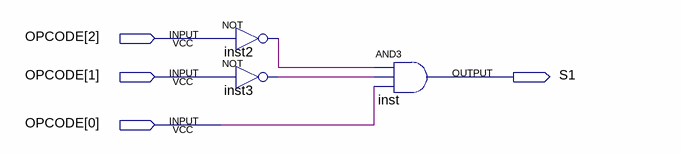
[diagram p0: schematic sheet]
// Quartus schematic DecoSUMA.bdf as structural Verilog: 3 symbols, 4 pins
module DecoSUMA (
  input  [2:0] OPCODE,
  output S1
);

  wire inst2_out, inst3_out;

  not inst2 (inst2_out, OPCODE[2]);
  not inst3 (inst3_out, OPCODE[1]);
  and inst (S1, inst2_out, inst3_out, OPCODE[0]);
endmodule
